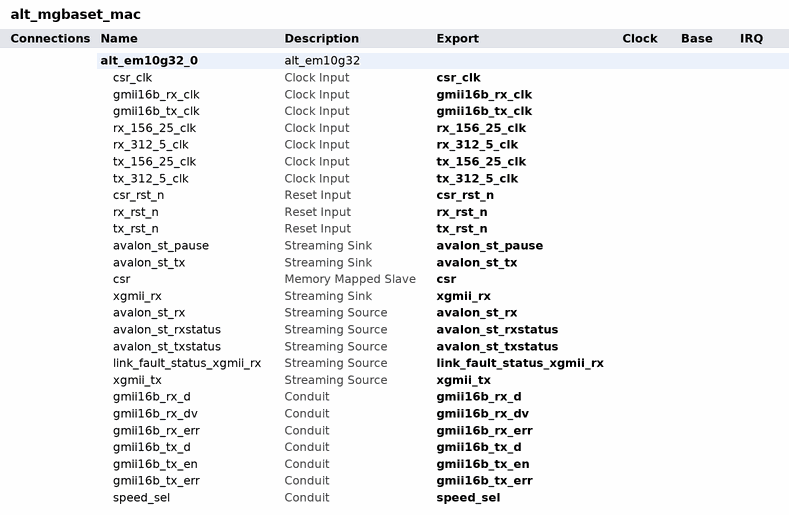
[diagram p0: system contents]
# Platform Designer (Qsys) system alt_mgbaset_mac, Arria 10 Unknown
# Parameters at their usual value, and those the tool derives, are not listed.
package require qsys
create_system alt_mgbaset_mac
set_project_property DEVICE_FAMILY {Arria 10}
set_project_property DEVICE Unknown

add_instance alt_em10g32_0 alt_em10g32 15.0
set_instance_property alt_em10g32_0 AUTO_EXPORT true
set_instance_parameter_value alt_em10g32_0 DATAPATH_OPTION 3
set_instance_parameter_value alt_em10g32_0 ENABLE_10GBASER_REG_MODE 0
set_instance_parameter_value alt_em10g32_0 ENABLE_1G10G_MAC 4
set_instance_parameter_value alt_em10g32_0 ENABLE_ED_FILESET_SIM 1
set_instance_parameter_value alt_em10g32_0 ENABLE_ED_FILESET_SYNTHESIS 1
set_instance_parameter_value alt_em10g32_0 ENABLE_MEM_ECC 0
set_instance_parameter_value alt_em10g32_0 ENABLE_PFC 0
set_instance_parameter_value alt_em10g32_0 ENABLE_PTP_1STEP 0
set_instance_parameter_value alt_em10g32_0 ENABLE_SUPP_ADDR 1
set_instance_parameter_value alt_em10g32_0 ENABLE_TIMESTAMPING 0
set_instance_parameter_value alt_em10g32_0 ENABLE_UNIDIRECTIONAL 0
set_instance_parameter_value alt_em10g32_0 INSERT_CSR_ADAPTOR 0
set_instance_parameter_value alt_em10g32_0 INSERT_ST_ADAPTOR 1
set_instance_parameter_value alt_em10g32_0 INSERT_XGMII_ADAPTOR 1
set_instance_parameter_value alt_em10g32_0 INSTANTIATE_STATISTICS 1
set_instance_parameter_value alt_em10g32_0 PFC_PRIORITY_NUMBER 8
set_instance_parameter_value alt_em10g32_0 PREAMBLE_PASSTHROUGH 0
set_instance_parameter_value alt_em10g32_0 REGISTER_BASED_STATISTICS 0
set_instance_parameter_value alt_em10g32_0 SELECT_ED_FILESET 0
set_instance_parameter_value alt_em10g32_0 SELECT_NUMBER_OF_CHANNEL 1
set_instance_parameter_value alt_em10g32_0 SELECT_SUPPORTED_VARIANT 0
set_instance_parameter_value alt_em10g32_0 SELECT_TARGETED_DEVICE 0
set_instance_parameter_value alt_em10g32_0 SHOW_HIDDEN_OPTIONS 1
set_instance_parameter_value alt_em10g32_0 TIME_OF_DAY_FORMAT 2
set_instance_parameter_value alt_em10g32_0 TSTAMP_FP_WIDTH 4

# exported interfaces
add_interface avalon_st_pause avalon_streaming sink
set_interface_property avalon_st_pause EXPORT_OF alt_em10g32_0.avalon_st_pause
add_interface avalon_st_rx avalon_streaming source
set_interface_property avalon_st_rx EXPORT_OF alt_em10g32_0.avalon_st_rx
add_interface avalon_st_rxstatus avalon_streaming source
set_interface_property avalon_st_rxstatus EXPORT_OF alt_em10g32_0.avalon_st_rxstatus
add_interface avalon_st_tx avalon_streaming sink
set_interface_property avalon_st_tx EXPORT_OF alt_em10g32_0.avalon_st_tx
add_interface avalon_st_txstatus avalon_streaming source
set_interface_property avalon_st_txstatus EXPORT_OF alt_em10g32_0.avalon_st_txstatus
add_interface csr avalon slave
set_interface_property csr EXPORT_OF alt_em10g32_0.csr
add_interface csr_clk clock sink
set_interface_property csr_clk EXPORT_OF alt_em10g32_0.csr_clk
add_interface csr_rst_n reset sink
set_interface_property csr_rst_n EXPORT_OF alt_em10g32_0.csr_rst_n
add_interface gmii16b_rx_clk clock sink
set_interface_property gmii16b_rx_clk EXPORT_OF alt_em10g32_0.gmii16b_rx_clk
add_interface gmii16b_rx_d conduit end
set_interface_property gmii16b_rx_d EXPORT_OF alt_em10g32_0.gmii16b_rx_d
add_interface gmii16b_rx_dv conduit end
set_interface_property gmii16b_rx_dv EXPORT_OF alt_em10g32_0.gmii16b_rx_dv
add_interface gmii16b_rx_err conduit end
set_interface_property gmii16b_rx_err EXPORT_OF alt_em10g32_0.gmii16b_rx_err
add_interface gmii16b_tx_clk clock sink
set_interface_property gmii16b_tx_clk EXPORT_OF alt_em10g32_0.gmii16b_tx_clk
add_interface gmii16b_tx_d conduit end
set_interface_property gmii16b_tx_d EXPORT_OF alt_em10g32_0.gmii16b_tx_d
add_interface gmii16b_tx_en conduit end
set_interface_property gmii16b_tx_en EXPORT_OF alt_em10g32_0.gmii16b_tx_en
add_interface gmii16b_tx_err conduit end
set_interface_property gmii16b_tx_err EXPORT_OF alt_em10g32_0.gmii16b_tx_err
add_interface link_fault_status_xgmii_rx avalon_streaming source
set_interface_property link_fault_status_xgmii_rx EXPORT_OF alt_em10g32_0.link_fault_status_xgmii_rx
add_interface rx_156_25_clk clock sink
set_interface_property rx_156_25_clk EXPORT_OF alt_em10g32_0.rx_156_25_clk
add_interface rx_312_5_clk clock sink
set_interface_property rx_312_5_clk EXPORT_OF alt_em10g32_0.rx_312_5_clk
add_interface rx_rst_n reset sink
set_interface_property rx_rst_n EXPORT_OF alt_em10g32_0.rx_rst_n
add_interface speed_sel conduit end
set_interface_property speed_sel EXPORT_OF alt_em10g32_0.speed_sel
add_interface tx_156_25_clk clock sink
set_interface_property tx_156_25_clk EXPORT_OF alt_em10g32_0.tx_156_25_clk
add_interface tx_312_5_clk clock sink
set_interface_property tx_312_5_clk EXPORT_OF alt_em10g32_0.tx_312_5_clk
add_interface tx_rst_n reset sink
set_interface_property tx_rst_n EXPORT_OF alt_em10g32_0.tx_rst_n
add_interface xgmii_rx avalon_streaming sink
set_interface_property xgmii_rx EXPORT_OF alt_em10g32_0.xgmii_rx
add_interface xgmii_tx avalon_streaming source
set_interface_property xgmii_tx EXPORT_OF alt_em10g32_0.xgmii_tx

set_interconnect_requirement {$system} qsys_mm.clockCrossingAdapter HANDSHAKE
set_interconnect_requirement {$system} qsys_mm.insertDefaultSlave FALSE
set_interconnect_requirement {$system} qsys_mm.maxAdditionalLatency 1

save_system alt_mgbaset_mac.qsys
